# EAGLE design RAMPS_1.4.2.3 (EAGLE 7.5.0)
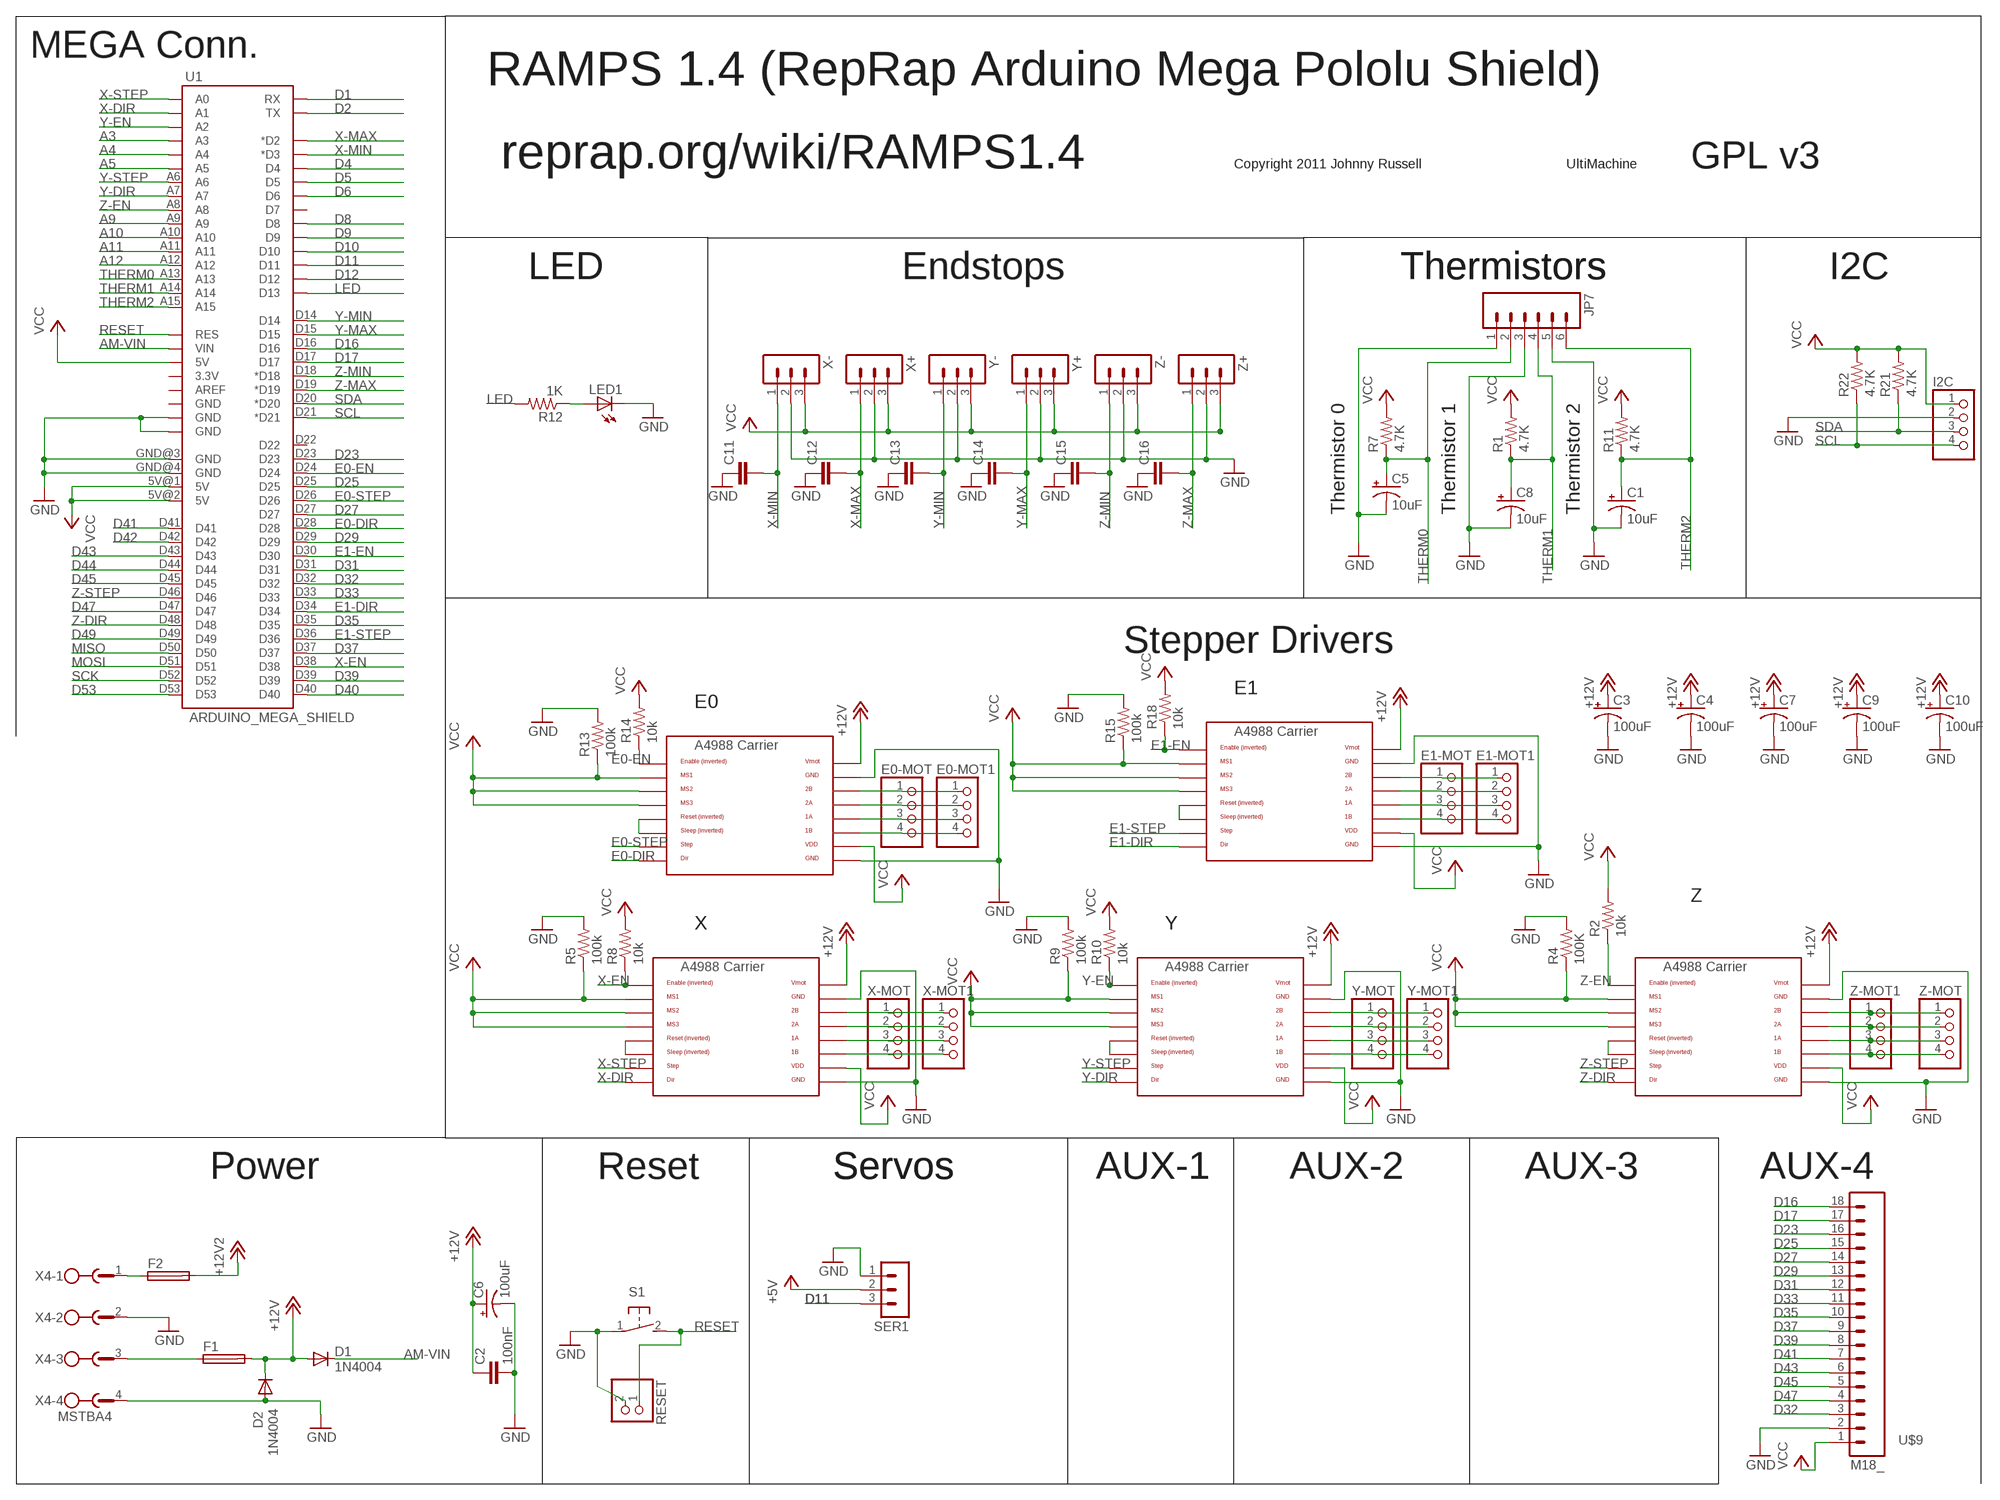
[diagram p0: schematic, sheet 1]

## Parts
C1  10uF  CPOL-US153CLV-0405  [153CLV-0405]
C2  100nF  C-EUC0805  [C0805]
C3  100uF  CPOL-US153CLV-0605  [153CLV-0605]
C4  100uF  CPOL-US153CLV-0605  [153CLV-0605]
C5  10uF  CPOL-US153CLV-0405  [153CLV-0405]
C6  100uF  CPOL-US153CLV-0605  [153CLV-0605]
C7  100uF  CPOL-US153CLV-0605  [153CLV-0605]
C8  10uF  CPOL-US153CLV-0405  [153CLV-0405]
C9  100uF  CPOL-US153CLV-0605  [153CLV-0605]
C10  100uF  CPOL-US153CLV-0605  [153CLV-0605]
C11  C-EUC0805  [C0805]
C12  C-EUC0805  [C0805]
C13  C-EUC0805  [C0805]
C14  C-EUC0805  [C0805]
C15  C-EUC0805  [C0805]
C16  C-EUC0805  [C0805]
D1  1N4004  [DO41-10]
D2  1N4004  [DO41-10]
E0-MOT  PINHD-1X4  [1X04]
E0-MOT1  PINHD-1X4  [1X04]
E1-MOT  PINHD-1X4  [1X04]
E1-MOT1  PINHD-1X4  [1X04]
F1  FUSE_MCCQ-122  [FUSE_MCCQ-122]
F2  FUSE_MCCQ-122  [FUSE_MCCQ-122]
I2C  PINHD-1X4  [1X04]
JP7  M06SIP  [1X06]
LED1  LEDCHIP-LED0805  [CHIP-LED0805]
R1  4.7K  R-US_R0805  [R0805]
R2  10k  RES-US1206FAB  [R1206FAB]
R4  100K  RES-US1206FAB  [R1206FAB]
R5  100k  RES-US1206FAB  [R1206FAB]
R7  4.7K  R-US_R0805  [R0805]
R8  10k  RES-US1206FAB  [R1206FAB]
R9  100k  RES-US1206FAB  [R1206FAB]
R10  10k  RES-US1206FAB  [R1206FAB]
R11  4.7K  R-US_R0805  [R0805]
R12  1K  R-US_R0805  [R0805]
R13  100k  RES-US1206FAB  [R1206FAB]
R14  10k  RES-US1206FAB  [R1206FAB]
R15  100k  RES-US1206FAB  [R1206FAB]
R18  10k  RES-US1206FAB  [R1206FAB]
R21  4.7K  R-US_R0805  [R0805]
R22  4.7K  R-US_R0805  [R0805]
RESET  PINHD-2  [PINHD-2]
S1  31-XX  [B3F-31XX]
SER1  3PIN-HEADER  [3PIN-HEADER]
U1  ARDUINO_MEGA_SHIELD  [ARDUINO_MEGA_SHIELD]
U$4  A4988BREAKOUT  [A4988BREAKOUT]
U$5  A4988BREAKOUT  [A4988BREAKOUT]
U$6  A4988BREAKOUT  [A4988BREAKOUT]
U$7  A4988BREAKOUT  [A4988BREAKOUT]
U$8  A4988BREAKOUT  [A4988BREAKOUT]
U$9  M18_  [1X18]
X4  MSTBA4  [MSTBA4]
X+  3PIN-HEADER  [3PIN-HEADER]
X-  3PIN-HEADER  [3PIN-HEADER]
X-MOT  PINHD-1X4  [1X04]
X-MOT1  PINHD-1X4  [1X04]
Y+  3PIN-HEADER  [3PIN-HEADER]
Y-  3PIN-HEADER  [3PIN-HEADER]
Y-MOT  PINHD-1X4  [1X04]
Y-MOT1  PINHD-1X4  [1X04]
Z+  3PIN-HEADER  [3PIN-HEADER]
Z-  3PIN-HEADER  [3PIN-HEADER]
Z-MOT  PINHD-1X4  [1X04]
Z-MOT1  PINHD-1X4  [1X04]

## Nets
+5V: SER1.2
+12V: C2.1 C3.+ C4.+ C6.+ C7.+ C9.+ C10.+ D1.A D2.C F1.2-1 F1.2-2 U$4.VMOT U$5.VMOT U$6.VMOT U$7.VMOT U$8.VMOT
+12V2: F2.2-1 F2.2-2
A3: U1.A3
A4: U1.A4
A5: U1.A5
A9: U1.A9
A10: U1.A10
A11: U1.A11
A12: U1.A12
AM-VIN: D1.C U1.VIN
D1: U1.RX
D2: U1.TX
D4: U1.D4
D5: U1.D5
D6: U1.D6
D8: U1.D8
D9: U1.D9
D10: U1.D10
D11: SER1.3 U1.D11
D12: U1.D12
D16: U1.D16 U$9.18
D17: U1.D17 U$9.17
D23: U1.D23 U$9.16
D25: U1.D25 U$9.15
D27: U1.D27 U$9.14
D29: U1.D29 U$9.13
D31: U1.D31 U$9.12
D32: U1.D32 U$9.3
D33: U1.D33 U$9.11
D35: U1.D35 U$9.10
D37: U1.D37 U$9.9
D39: U1.D39 U$9.8
D40: U1.D40
D41: U1.D41 U$9.7
D42: U1.D42
D43: U1.D43 U$9.6
D44: U1.D44
D45: U1.D45 U$9.5
D47: U1.D47 U$9.4
D49: U1.D49
D53: U1.D53
E0-DIR: U1.D28 U$4.DIR
E0-EN: R14.1 U1.D24 U$4.EN
E0-STEP: U1.D26 U$4.STEP
E1-DIR: U1.D34 U$5.DIR
E1-EN: R18.1 U1.D30 U$5.EN
E1-STEP: U1.D36 U$5.STEP
GND: C1.- C2.2 C3.- C4.- C5.- C6.- C7.- C8.- C9.- C10.- C11.1 C12.1 C13.1 C14.1 C15.1 C16.1 D2.A I2C.2 JP7.1 JP7.3 JP7.5 LED1.C R4.2 R5.2 R9.2 R13.2 R15.2 RESET.2 S1.1(P) SER1.1 U1.GND@0(GND) U1.GND@1(GND) U1.GND@3(GND) U1.GND@4(GND) U$4.GND U$4.GND@0(GND) U$5.GND U$5.GND@0(GND) U$6.GND U$6.GND@0(GND) U$7.GND U$7.GND@0(GND) U$8.GND U$8.GND@0(GND) U$9.2 X4.2 X4.4 X+.2 X-.2 Y+.2 Y-.2 Z+.2 Z-.2
LED: R12.2 U1.D13
MISO: U1.D50
MOSI: U1.D51
N$3: E0-MOT1.1 E0-MOT.1 U$4.2B
N$4: E0-MOT1.2 E0-MOT.2 U$4.2A
N$8: U$4.RST U$4.SLP(SLEEP)
N$10: E0-MOT1.3 E0-MOT.3 U$4.1A
N$11: E0-MOT1.4 E0-MOT.4 U$4.1B
N$12: E1-MOT1.1 E1-MOT.1 U$5.2B
N$13: E1-MOT1.2 E1-MOT.2 U$5.2A
N$16: E1-MOT1.3 E1-MOT.3 U$5.1A
N$18: E1-MOT1.4 E1-MOT.4 U$5.1B
N$20: U$6.RST U$6.SLP(SLEEP)
N$21: U$6.2B X-MOT1.1 X-MOT.1
N$22: U$6.2A X-MOT1.2 X-MOT.2
N$23: U$7.RST U$7.SLP(SLEEP)
N$24: U$5.RST U$5.SLP(SLEEP)
N$26: U$6.1A X-MOT1.3 X-MOT.3
N$27: U$6.1B X-MOT1.4 X-MOT.4
N$28: U$7.2B Y-MOT1.1 Y-MOT.1
N$29: U$7.2A Y-MOT1.2 Y-MOT.2
N$30: U$7.1A Y-MOT1.3 Y-MOT.3
N$36: U$7.1B Y-MOT1.4 Y-MOT.4
N$38: U$8.RST U$8.SLP(SLEEP)
N$41: U$8.2B Z-MOT1.1 Z-MOT.1
N$42: U$8.2A Z-MOT1.2 Z-MOT.2
N$43: U$8.1A Z-MOT1.3 Z-MOT.3
N$44: U$8.1B Z-MOT1.4 Z-MOT.4
N$46: LED1.A R12.1
N$53: F2.1-1 F2.1-2 X4.1
N$54: F1.1-1 F1.1-2 X4.3
RESET: RESET.1 S1.2(S) U1.RES
SCK: U1.D52
SCL: I2C.4 R22.1 U1.D21(*D21)
SDA: I2C.3 R21.1 U1.D20(*D20)
THERM0: C5.+ JP7.2 R7.1 U1.A13
THERM1: C8.+ JP7.4 R1.1 U1.A14
THERM2: C1.+ JP7.6 R11.1 U1.A15
VCC: I2C.1 R1.2 R2.2 R4.1 R5.1 R7.2 R8.2 R9.1 R10.2 R11.2 R13.1 R14.2 R15.1 R18.2 R21.2 R22.2 U1.5V@0(5V) U1.5V@1(5V) U1.5V@2(5V) U$4.MS1 U$4.MS2 U$4.MS3 U$4.VDD U$5.MS1 U$5.MS2 U$5.MS3 U$5.VDD U$6.MS1 U$6.MS2 U$6.MS3 U$6.VDD U$7.MS1 U$7.MS2 U$7.MS3 U$7.VDD U$8.MS1 U$8.MS2 U$8.MS3 U$8.VDD U$9.1 X+.3 X-.3 Y+.3 Y-.3 Z+.3 Z-.3
X-DIR: U1.A1 U$6.DIR
X-EN: R8.1 U1.D38 U$6.EN
X-MAX: C12.2 U1.D2(*D2) X+.1
X-MIN: C11.2 U1.D3(*D3) X-.1
X-STEP: U1.A0 U$6.STEP
Y-DIR: U1.A7 U$7.DIR
Y-EN: R10.1 U1.A2 U$7.EN
Y-MAX: C14.2 U1.D15 Y+.1
Y-MIN: C13.2 U1.D14 Y-.1
Y-STEP: U1.A6 U$7.STEP
Z-DIR: U1.D48 U$8.DIR
Z-EN: R2.1 U1.A8 U$8.EN
Z-MAX: C16.2 U1.D19(*D19) Z+.1
Z-MIN: C15.2 U1.D18(*D18) Z-.1
Z-STEP: U1.D46 U$8.STEP
Unconnected: U1.3.3V U1.AREF U1.D7 U1.D22 U1.GND@2(GND)

## Notes on the sheet
- MEGA Conn.
- RAMPS 1.4 (RepRap Arduino Mega Pololu Shield)
- reprap.org/wiki/RAMPS1.4 | Copyright 2011 Johnny Russell | UltiMachine | GPL v3
- LED | Endstops | Thermistors | Thermistors | I2C
- Thermistor 0 | Thermistor 1 | Thermistor 2
- Stepper Drivers
- E1
- E0
- Z
- X | Y
- Power | Reset | Servos | Servos | AUX-1 | AUX-2 | AUX-3 | AUX-4

## Library data of the parts
C1 C3-C10 = adafruit:CPOL-US: POLARIZED CAPACITOR, American symbol
C2 = resistor:C-EU: CAPACITOR, European symbol
C11-C16 = rcl:C-EU: CAPACITOR, European symbol
D1 D2 = diode:1N4004: DIODE general purpose rectifier, 1 A
E0-MOT E0-MOT1 E1-MOT E1-MOT1 I2C X-MOT X-MOT1 Y-MOT Y-MOT1 Z-MOT Z-MOT1 = RepRapjr:PINHD-1X4: PIN HEADER
F1 F2 = myLib:FUSE_MCCQ-122
JP7 = SparkFun:M06: Header 6 Standard 6-pin 0.1" header. Use with straight break away headers (SKU : PRT-00116), right angle break away headers (PRT-00553), swiss pins (PRT-00743), machine pins (PRT-00117), and female headers (PRT-00115). Molex polarized connector foot print use with SKU : PRT-08094 with associated crimp pins and housings. NOTES ON THE VARIANTS LOCK and LOCK_LONGPADS... This footprint was designed to help hold the alignment of a through-hole component (i.e. 6-pin header) while soldering it into place. You may notice that each hole has been shifted either up or down by 0.005 of an inch from it's more standard position (which is a perfectly straight line). This slight alteration caused the pins (the squares in the middle) to touch the edges of the holes. Because they are alternating, it causes a "brace" to hold the component in place. 0.005 has proven to be the perfect amount of "off-center" position when using our standard breakaway headers. Although looks a little odd when you look at the bare footprint, once you have a header in there, the alteration is very hard to notice. Also, if you push a header all the way into place, it is covered up entirely on the bottom side. This idea of altering the position of holes to aid alignment will be further integrated into the Sparkfun Library for other footprints. It can help hold any component with 3 or more connection pins.
LED1 = led:LED: LED OSRAM: - CHIPLED LG R971, LG N971, LY N971, LG Q971, LY Q971, LO R971, LY R971 LH N974, LH R974 LS Q976, LO Q976, LY Q976 LO Q996 - Hyper CHIPLED LW Q18S LB Q993, LB Q99A, LB R99A - SideLED LS A670, LO A670, LY A670, LG A670, LP A670 LB A673, LV A673, LT A673, LW A673 LH A674 LY A675 LS A676, LA A676, LO A676, LY A676, LW A676 LS A679, LY A679, LG A679 - Hyper Micro SIDELED® LS Y876, LA Y876, LO Y876, LY Y876 LT Y87S - SmartLED LW L88C, LW L88S LB L89C, LB L89S, LG L890 LS L89K, LO L89K, LY L89K LS L896, LA L896, LO L896, LY L896 - TOPLED LS T670, LO T670, LY T670, LG T670, LP T670 LSG T670, LSP T670, LSY T670, LOP T670, LYG T670 LG T671, LOG T671, LSG T671 LB T673, LV T673, LT T673, LW T673 LH T674 LS T676, LA T676, LO T676, LY T676, LB T676, LH T676, LSB T676, LW T676 LB T67C, LV T67C, LT T67C, LS T67K, LO T67K, LY T67K, LW E67C LS E67B, LA E67B, LO E67B, LY E67B, LB E67C, LV E67C, LT E67C LW T67C LS T679, LY T679, LG T679 LS T770, LO T770, LY T770, LG T770, LP T770 LB T773, LV T773, LT T773, LW T773 LH T774 LS E675, LA E675, LY E675, LS T675 LS T776, LA T776, LO T776, LY T776, LB T776 LHGB T686 LT T68C, LB T68C - Hyper Mini TOPLED® LB M676 - Mini TOPLED Santana® LG M470 LS M47K, LO M47K, LY M47K Source: http://www.osram.convergy.de LUXEON: - LUMILED® LXK2-PW12-R00, LXK2-PW12-S00, LXK2-PW14-U00, LXK2-PW14-V00 LXK2-PM12-R00, LXK2-PM12-S00, LXK2-PM14-U00 LXK2-PE12-Q00, LXK2-PE12-R00, LXK2-PE12-S00, LXK2-PE14-T00, LXK2-PE14-U00 LXK2-PB12-K00, LXK2-PB12-L00, LXK2-PB12-M00, LXK2-PB14-N00, LXK2-PB14-P00, LXK2-PB14-Q00 LXK2-PR12-L00, LXK2-PR12-M00, LXK2-PR14-Q00, LXK2-PR14-R00 LXK2-PD12-Q00, LXK2-PD12-R00, LXK2-PD12-S00 LXK2-PH12-R00, LXK2-PH12-S00 LXK2-PL12-P00, LXK2-PL12-Q00, LXK2-PL12-R00 Source: www.luxeon.com KINGBRIGHT: KA-3528ASYC Source: www.kingbright.com
R1 R7 R11 R12 R21 R22 = adafruit:R-US_: RESISTOR, American symbol
R2 R4 R5 R8-R10 R13-R15 R18 = fab:RES-US: Resistor (US Symbol) Variants with postfix FAB are widened to allow the routing of internal traces
RESET = myLib:PINHD-2
S1 = switch-omron:31-XX: OMRON SWITCH; MPN: B3F-3100; OC_FARNELL: 959704; OC_NEWARK: 36M3582
SER1 X+ X- Y+ Y- Z+ Z- = ultimachine:3PIN-HEADER: PIN HEADER
U1 = RepRapjr:ARDUINO_MEGA_SHIELD
U$4-U$8 = RepRapjr:A4988BREAKOUT
U$9 = SparkFun:M18
X4 = con-phoenix-508:MSTBA4: PHOENIX

## Board
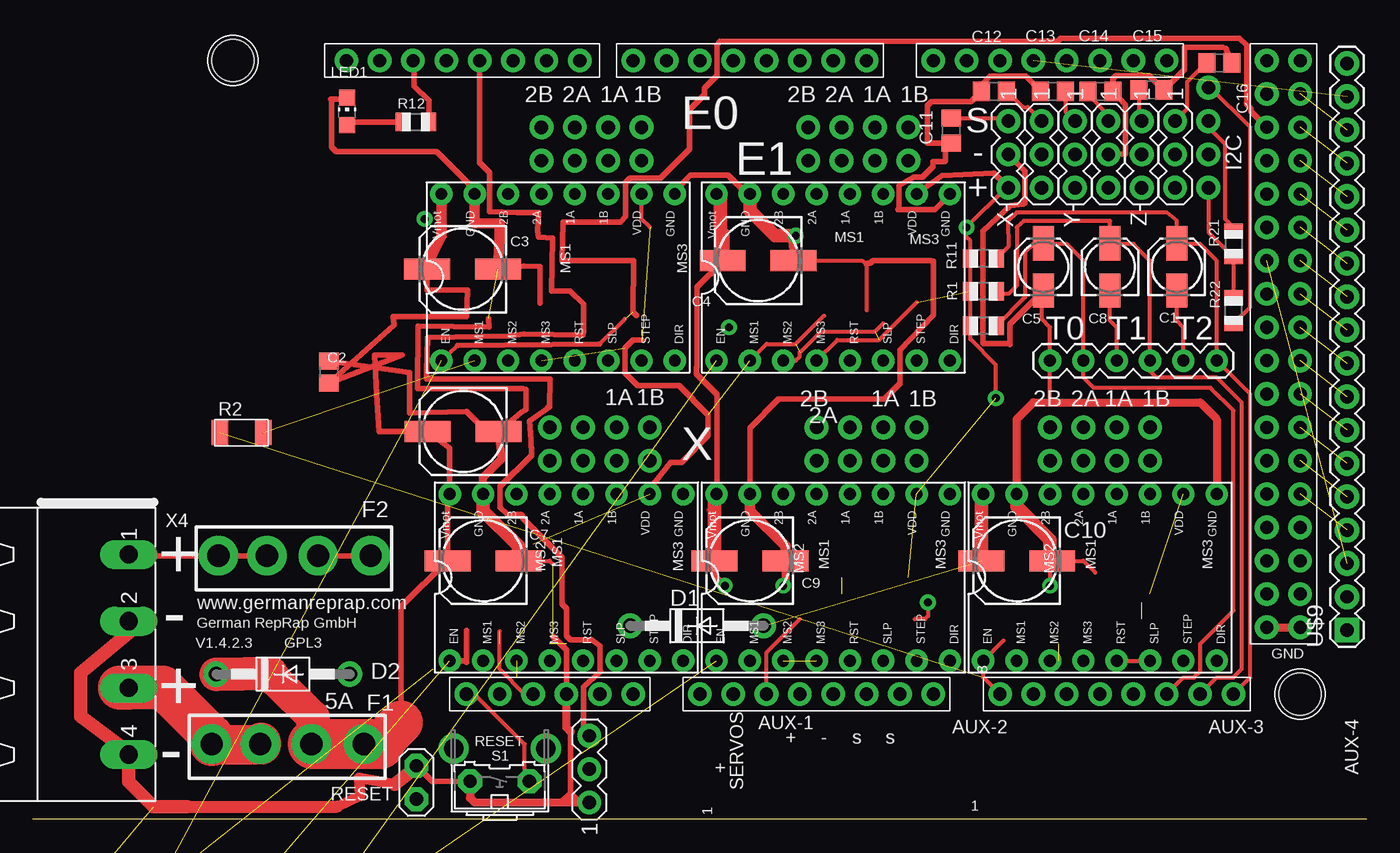
[diagram p1: board, top side]
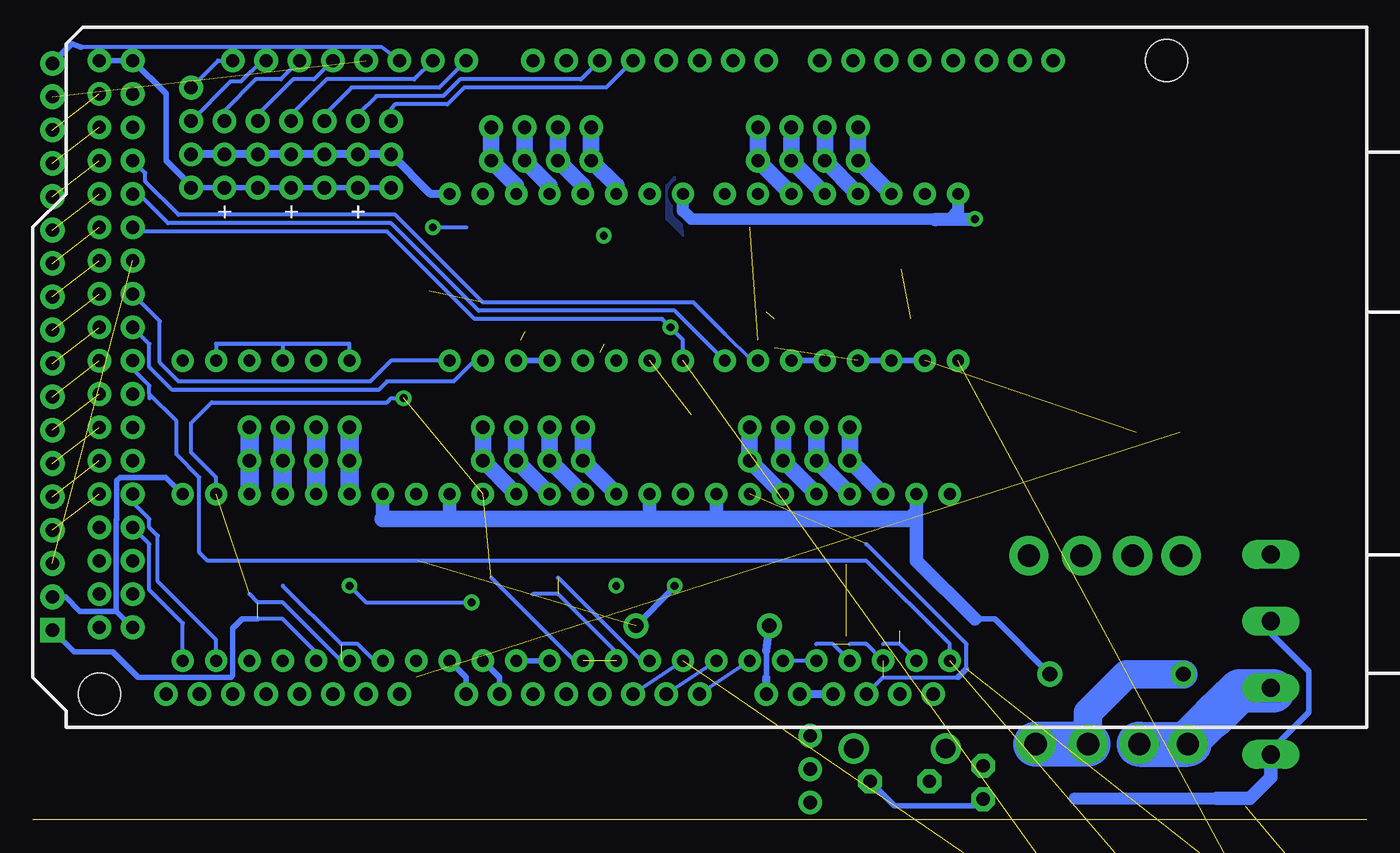
[diagram p2: board, bottom side, seen from below]

Size 101.59 x 0 mm. Coordinates in mm from the lower left corner, seen from the top.
Outline: 101.59,0 0,0
Copper layers (1*16): Top 0.035mm / dielectric 1.6mm / Bottom 0.035mm
Design rules "PCB-CART *": minimum track width 0.2mm, minimum drill 0.4mm, track to track 0.3mm, track to pad 0.3mm, pad to pad 0.2mm, via to via 0.2mm, smd to smd 0.2mm, copper to edge 0.2mm, drill to drill 0.2mm, minimum pad ring 0.4mm, minimum via ring 0.3mm, stop-mask expansion 3mil, vias tented up to drill 0.5mm, thermal gap 12mil

### Footprints (pad centres in the part's own frame; a part is rotated, then mirrored left to right if it is on the bottom)
153CLV-0405 = smd 2.6 x 1.6: + 1.8,0; - -1.8,0
C0805 = smd 1.3 x 1.5: 1 -0.85,0; 2 0.85,0
153CLV-0605 = smd 3.5 x 1.6: + 2.7,0; - -2.7,0
C0805' = smd 1.3 x 1.5: 1 -0.95,0; 2 0.95,0
DO41-10 = drill 1.118: A 5.08,0; C -5.08,0
1X04 = drill 1.016: 1 -2.54,0; 2 0,0; 3 2.54,0; 4 5.08,0
FUSE_MCCQ-122 = drill 1.7 pad 3: 1-1 -6.7,0; 1-2 -3,0; 2-1 4.9,0; 2-2 0.9,0
1X06 = drill 0.9 pad 1.422: 1 0,0; 2 2.54,0; 3 5.08,0; 4 7.62,0; 5 10.16,0; 6 12.7,0
CHIP-LED0805 = smd 1.2 x 1.2: A 0,-1.05; C 0,1.05
R0805 = smd 1.1 x 1.4: 1 -1,0; 2 1,0
R1206FAB = smd 1.27 x 1.905: 1 -1.651,0; 2 1.651,0
PINHD-2 = drill 1.016 octagon: 1 -1.27,0; 2 1.27,0
B3F-31XX = drill 1.016 octagon: 1 -2.261,-1.245; 2 2.261,-1.245 | drill 1.499 pad 2.159: 3 -3.505,1.245; 4 3.505,1.245
3PIN-HEADER = drill 1.016: 1 -2.54,0; 2 0,0; 3 2.54,0
ARDUINO_MEGA_SHIELD = drill 1 pad 1.422: 3.3V 35.56,2.54; 5V@0 38.1,2.54; 5V@1 93.98,50.8; 5V@2 96.52,50.8; A0 50.8,2.54; A1 53.34,2.54; A2 55.88,2.54; A3 58.42,2.54; A4 60.96,2.54; A5 63.5,2.54; A6 66.04,2.54; A7 68.58,2.54; A8 73.66,2.54; A9 76.2,2.54; A10 78.74,2.54; A11 81.28,2.54; A12 83.82,2.54; A13 86.36,2.54; A14 88.9,2.54; A15 91.44,2.54; AREF 23.876,50.8; D2 58.42,50.8; D3 55.88,50.8; D4 53.34,50.8; D5 50.8,50.8; D6 48.26,50.8; D7 45.72,50.8; D8 41.656,50.8; D9 39.116,50.8; D10 36.576,50.8; D11 34.036,50.8; D12 31.496,50.8; D13 28.956,50.8; D14 68.58,50.8; D15 71.12,50.8; D16 73.66,50.8; D17 76.2,50.8; D18 78.74,50.8; D19 81.28,50.8; D20 83.82,50.8; D21 86.36,50.8; D22 93.98,48.26; D23 96.52,48.26; D24 93.98,45.72; D25 96.52,45.72; D26 93.98,43.18; D27 96.52,43.18; D28 93.98,40.64; D29 96.52,40.64; D30 93.98,38.1; D31 96.52,38.1; D32 93.98,35.56; D33 96.52,35.56; D34 93.98,33.02; D35 96.52,33.02; D36 93.98,30.48; D37 96.52,30.48; D38 93.98,27.94; D39 96.52,27.94; D40 93.98,25.4; D41 96.52,25.4; D42 93.98,22.86; D43 96.52,22.86; D44 93.98,20.32; D45 96.52,20.32; D46 93.98,17.78; D47 96.52,17.78; D48 93.98,15.24; D49 96.52,15.24; D50 93.98,12.7; D51 96.52,12.7; D52 93.98,10.16; D53 96.52,10.16; GND@0 40.64,2.54; GND@1 43.18,2.54; GND@2 26.416,50.8; GND@3 93.98,7.62; GND@4 96.52,7.62; RES 33.02,2.54; RX 63.5,50.8; TX 60.96,50.8; VIN 45.72,2.54 | hole 3.2: 96.52,2.54; 15.24,50.8
A4988BREAKOUT = drill 0.9: 1A 8.89,1.27; 1B 11.43,1.27; 2A 6.35,1.27; 2B 3.81,1.27; DIR 16.51,-11.43; EN -1.27,-11.43; GND 16.51,1.27; GND@0 1.27,1.27; MS1 1.27,-11.43; MS2 3.81,-11.43; MS3 6.35,-11.43; RST 8.89,-11.43; SLP 11.43,-11.43; STEP 13.97,-11.43; VDD 13.97,1.27; VMOT -1.27,1.27
1X18 = drill 1.016 pad 1.88 square: 1 0,0 | drill 1.016 pad 1.88: 2 2.54,0; 3 5.08,0; 4 7.62,0; 5 10.16,0; 6 12.7,0; 7 15.24,0; 8 17.78,0; 9 20.32,0; 10 22.86,0; 11 25.4,0; 12 27.94,0; 13 30.48,0; 14 33.02,0; 15 35.56,0; 16 38.1,0; 17 40.64,0; 18 43.18,0
MSTBA4 = drill 1.397 long: 1 -7.62,5.08; 2 -2.54,5.08; 3 2.54,5.08; 4 7.62,5.08

### Placement (x,y rotation side)
C1  87.12,42.06 90 top  (outside the outline)
C2  22.55,34.06 90 top  (outside the outline)
C3  32.74,41.89 180 top  (outside the outline)
C4  55.24,42.54 180 top  (outside the outline)
C5  76.96,42.06 90 top  (outside the outline)
C6  32.77,29.54 180 top  (outside the outline)
C7  34.29,19.69 180 top  (outside the outline)
C8  82.04,42.06 90 top  (outside the outline)
C9  54.61,19.69 180 top  (outside the outline)
C10  74.93,19.69 180 top  (outside the outline)
C11  [C0805']  69.95,52.45 90 top  (outside the outline)
C12  [C0805']  73.2,55.45 0 top  (outside the outline)
C13  [C0805']  77.7,55.45 0 top  (outside the outline)
C14  [C0805']  81.3,55.45 180 top  (outside the outline)
C15  [C0805']  85.2,55.54 180 top  (outside the outline)
C16  [C0805']  90.35,57.59 180 top  (outside the outline)
D1  50.57,14.73 0 top  (outside the outline)
D2  19.05,11.05 0 top  (outside the outline)
E0-MOT  41.27,52.7 0 top  (outside the outline)
E0-MOT1  41.27,50.16 0 top  (outside the outline)
E1-MOT  61.59,52.7 0 top  (outside the outline)
E1-MOT1  61.59,50.16 0 top  (outside the outline)
F1  20.32,5.71 0 top  (outside the outline)
F2  20.83,20.07 0 top  (outside the outline)
I2C  89.53,50.64 90 top  (outside the outline)
JP7  77.47,34.92 0 top  (outside the outline)
LED1  23.93,53.91 0 top  (outside the outline)
R1  72.39,40.22 180 top  (outside the outline)
R2  15.9,29.45 0 top  (outside the outline)
R4  -14.95,-25.76 0 top  (outside the outline)
R5  -14.95,-40.41 0 top  (outside the outline)
R7  72.39,37.58 180 top  (outside the outline)
R8  -14.95,-44.16 0 top  (outside the outline)
R9  -14.95,-31.2 0 top  (outside the outline)
R10  -14.95,-34.95 0 top  (outside the outline)
R11  72.39,42.7 180 top  (outside the outline)
R12  29.18,53.11 0 top  (outside the outline)
R13  -14.95,-49.61 0 top  (outside the outline)
R14  -14.95,-53.36 0 top  (outside the outline)
R15  -14.95,-57.11 0 top  (outside the outline)
R18  -14.95,-60.86 0 top  (outside the outline)
R21  91.44,43.81 270 top  (outside the outline)
R22  91.44,38.73 90 top  (outside the outline)
RESET  29.21,2.79 90 top
S1  35.56,4.13 0 top
SER1  42.39,3.81 90 top
U1  0,6.98 0 top  (outside the outline)
U$4  32.38,46.35 0 top  (outside the outline)
U$5  53.34,46.35 0 top  (outside the outline)
U$6  33.02,23.49 0 top  (outside the outline)
U$7  53.34,23.49 0 top  (outside the outline)
U$8  73.66,23.49 0 top  (outside the outline)
U$9  100.1,14.39 90 top  (outside the outline)
X4  2.22,12.54 270 top  (outside the outline)
X+  76.83,50.64 270 top  (outside the outline)
X-  74.3,50.64 270 top  (outside the outline)
X-MOT  41.91,29.84 0 top  (outside the outline)
X-MOT1  41.91,27.3 0 top  (outside the outline)
Y+  81.92,50.64 270 top  (outside the outline)
Y-  79.38,50.64 270 top  (outside the outline)
Y-MOT  62.23,29.84 0 top  (outside the outline)
Y-MOT1  62.23,27.3 0 top  (outside the outline)
Z+  87,50.64 270 top  (outside the outline)
Z-  84.45,50.64 270 top  (outside the outline)
Z-MOT  80.01,29.84 0 top  (outside the outline)
Z-MOT1  80.01,27.3 0 top  (outside the outline)

### Tracks (layer width: path | path; a pad name or v marks a point on that pad's centre or on a via)
+12V  (via drill 0.6)  (1 unrouted)
  Top 0.2: 21.59,5.71 F1.2-2
  Top 0.406: C9.+ 51.91,18.57 v52.7,17.78 | C3.+ 30.04,40.29 33.1,40.29 33.05,38.29 27.45,38.29 27.5,37.64 C2.1 28.13,35.34 26.05,35.34 26.2,32.39 26.36,29.54 C6.+ 31.75,28.26 U$6.VMOT 31.59,24.6 C7.+ 31.54,19.69 28.05,16.2 28.05,7.38 28.07,7.37 | U$7.VMOT 52.1,24.79 52.1,32.34 50.55,33.89 50.55,34.39 50.6,34.45 50.6,40.54 52.55,42.49 C4.+
  Top 0.813: C3.+ 30.44,43.07 31.11,44.45 U$4.VMOT
  Top 1.016: C9.+ 51.91,24.6 U$7.VMOT | C10.+ 72.23,24.6 U$8.VMOT | C4.+ 52.55,44.61 52.39,44.77 52.39,47.31 U$5.VMOT
  Top 2.54: D2.C 18.14,11.1 18.54,10.54 21.34,7.75 21.34,5.83
  Top 3.302: 21.34,5.83 F1.2-2 | 26.42,5.71 28.07,7.37
  Top 3.81: 26.42,5.71 21.59,5.71 21.34,5.71
  Bottom 0.406: v52.7,17.78 52.7,17.68 D1.A
  Bottom 0.914: U$4.VMOT 31.11,46.35 31.75,45.72 32.84,45.67 51.44,45.72 52.07,46.35 U$5.VMOT
  Bottom 1.016: 32.84,45.67 v29.84,45.72
  Bottom 1.27: U$6.VMOT
  Bottom 2.184: F1.2-2 21.25,8.09 18.29,11.05 D2.C
  Bottom 3.429: F1.2-2 F1.2-1
  pour Top: 51.44,24.13 51.44,23.49 52.07,24.77
+12V2
  Top 0.406: F2.2-2 F2.2-1
AM-VIN
  Bottom 0.406: 45.72,10.79 45.72,12.81
  Bottom 0.61: 45.72,12.81 D1.C | U1.VIN 45.72,10.79
D11
  Top 0.406: SER1.3 41.95,6.79 41.95,10.1 43.25,11.24 43.2,11.39 43.2,13.19 42.6,13.64 40.95,13.64 40.65,13.94 40.65,16.05 40.3,16.39 40.3,19.95 37.3,22.95 37.3,23.09 37.2,23.2 36.15,23.2 35.6,23.74 35.6,25.34 38,27.7 37.95,28.84 | 38,27.89 37.95,28.84 | 37.95,28.84 37.85,30.34 39.35,31.39 | 39.2,31.34 39.35,31.39 | 39.35,31.39 39.4,33.54 30,33.54 30,34.09 30.05,36.7 36.25,36.79 37.4,36.95 41.9,36.89 41.95,37.09 41.95,39.24 40.9,40.24 39.5,40.24 39.6,44.24 38.5,44.34 38.45,44.84 38.5,46.2 36.9,46.2 34.8,46.29 34.8,49.24 34.04,50.01 U1.D11
D16
  Bottom 0.305: 97.89,58.8 75.03,58.8 U1.D16
  Bottom 0.406: U$9.18 98.62,59.05 97.89,58.8
D17  (1 unrouted)
D23  (1 unrouted)
D25  (1 unrouted)
D27  (1 unrouted)
D29  (1 unrouted)
D31  (1 unrouted)
D32  (1 unrouted)
D33  (1 unrouted)
D35  (1 unrouted)
D37  (1 unrouted)
D39  (1 unrouted)
D41  (1 unrouted)
D43  (1 unrouted)
D45  (1 unrouted)
D47  (1 unrouted)
E0-DIR
  Bottom 0.305: U1.D28 93.5,47.62 91.28,45.4 74.3,45.4 67.63,38.73 52.7,38.73 U$4.DIR
E0-EN  (2 unrouted)
  Top 0.305: 43.18,36.2 45.09,38.1 | U$4.EN 32.34,36.09
  Top 0.406: 32.34,36.09 43.18,36.2 | U1.D24 92.75,53.93 92.75,54.14 92.45,54.45 92.45,58.95 91.9,59.49 78.3,59.49 78.05,59.24 52.35,59.24 52.1,58.99 52.1,56.65 51.15,55.7 51.15,55.2 50,54.04 50,51.04 47.8,48.84 45.5,48.84 45.15,48.49 45.15,45.89 44.75,45.49 40.4,45.49 40.3,42.54 45.75,42.54 45.7,38.64 45.99,38.35
E0-STEP
  Bottom 0.254: 48.9,36.99 46.83,34.92 U$4.STEP
  Bottom 0.305: U1.D26 93.03,49.21 93.03,48.58 90.49,46.04 73.98,46.04 67.31,39.37 51.28,39.37 48.9,36.99
E1-DIR
  Bottom 0.305: U1.D34 91.92,37.94 91.92,34.77 90.49,33.34 75.88,33.34 74.3,34.92 U$5.DIR
E1-EN  (via drill 0.6)  (1 unrouted)
  Bottom 0.305: U1.D30 93.66,44.77 74.61,44.77 67.94,38.1 53.66,38.1 v53.02,37.46 52.07,36.51 U$5.EN
E1-STEP
  Bottom 0.305: U1.D36 92.71,36.2 92.71,34.45 90.96,32.7 75.25,32.7 74.61,33.34 69.53,33.34 67.94,34.92 U$5.STEP
GND  (via drill 0.6)  (7 unrouted)
  Top 0.305: 80.92,18.78 80.01,19.69 C10.- 77.47,19.52 v77.47,17.78 | C5.- 76.83,40.13 76.83,38.1 77.47,37.46 JP7.1 77.47,31.75 | 67.17,15.24 67.94,15.24 68.17,15.47 v68.17,16.51 | 39.64,19.41 39.37,19.69 C7.- | 63.5,38.77 63.5,42.23 63.18,42.54 C4.- | C8.- 82.04,37.97 82.55,37.46 JP7.3 | C1.- 87.12,37.97 87.63,37.46 JP7.5
  Top 0.406: 40.96,1.9 40.96,6.67 | LED1.C 23.81,54.84 22.7,54.84 22.75,54.79 22.75,51.2 23.1,50.84 30.75,50.84 33.66,47.94 U$4.GND@0 | 29.12,3.86 RESET.2 30.39,2.88 S1.1 | U1.GND@0 40.65,12.89 39.64,13.9 | C3.- 37.39,42.14 38.65,42.09 38.65,39.31 | C2.2 28.7,34.01 28.7,30.95 33.05,31.04 34.41,29.69 C6.- 37.18,30.99 37.55,31.2 37.55,32.74 37.3,32.79 29.3,32.79 29.35,37.54 34.75,37.49 34.7,38.15 | C16.1 90.85,58.74 90.6,58.79 87.7,58.79 87.7,57.09 C15.1 85.05,56.65 82.5,56.65 82.25,56.4 C14.1 83.2,54.45 83.2,50.64 Y+.2 | C13.1 75.65,56.59 72.9,56.59 72.25,55.9 C12.1 71.45,54.64 68.45,54.64 68.15,54.34 68.15,51.49 C11.1 69.5,51.04 69.5,50.14 69.45,50.09 68.55,50.09 68.55,49.7 67.75,48.89 67.05,48.89 65.95,48.24 65.95,46.54 65.9,46.45 68.72,46.45 U$5.GND | C5.- 74.4,37.7 74.4,36.14 74.3,36.24 72.4,36.24 72.35,36.29 72.35,44.79 74.45,46.74 75.45,46.84 75.55,46.95 75.55,49.34 X-.2 | U$5.GND@0 54.09,48.14 53.85,48.14 52.95,49.04 50.1,49.04 48.9,47.84 U$4.GND | 63.5,42.23 63.62,42.34 63.8,42.34 64,42.54 68.4,42.54 68.6,42.49 68.6,38.39 66.05,35.74 66.05,33.2 64.85,31.99 56.8,31.99 54.61,29.8 U$7.GND@0
  Top 0.61: U1.GND@3 U1.GND@4 | U$8.GND 90.17,30.48 88.9,31.75 77.47,31.75 76.2,31.75 74.93,30.48 U$8.GND@0 | S1.1 33.3,1.63 33.66,1.27 40.32,1.27 | 40.96,1.27 40.96,1.9 | 40.96,6.67 40.64,6.98 U1.GND@0 | 40.32,1.27 40.96,1.27 | 57.78,44.45 57.95,43.02 C4.- 57.95,44.29 v58.1,44.45 | v57.15,17.78 57.31,17.94 C9.- | 40.96,1.27 41.59,1.27 | 41.59,1.27 SER1.1 | SER1.1 | 40.32,1.27 40.96,1.9 | 40.96,1.9 41.59,1.27 | C6.- 35.72,27.46 34.29,26.03 U$6.GND@0 | U$6.GND@0
  Top 0.813: C3.- 35.54,44.19 35.56,45.37 33.64,45.42 33.66,46.35 U$4.GND@0 | C9.- 57.31,20.8 54.61,23.49 U$7.GND@0 | 23.18,0.95 24.92,1.79 24.85,3.16 27.55,2.64
  Top 0.914: 11.75,0.95 23.18,0.95
  Top 1.016: C7.- 36.99,20.8 34.29,23.49 U$6.GND@0 | U$8.GND@0 74.93,23.81 77.47,21.27 77.47,19.84 C10.- | U$5.GND@0 54.61,46.35 56.52,44.45 57.78,44.45 | 11.75,0.95 9.21,0.95 7.3,2.86 7.3,5.08 3.65,7.83 3.65,11.14 7.3,14.2 X4.2 | 27.55,2.64 29.12,3.86
  Bottom 0.305: 77.47,35.24 JP7.1 77.47,36.2 82.55,36.2 | v68.17,16.51 76.2,16.51 v77.47,17.78 | 82.55,36.2 JP7.3 | 82.55,36.2 87.63,36.2 JP7.5 | Z+.2
  Bottom 0.406: D2.A 28.32,15.24 29.84,15.24 | 7.46,5.08 4.4,8.14 4.4,11.24 7.22,14.07 7.22,14.12 7.3,14.2 X4.2 | U1.GND@3 95.22,15.85 | 95.22,15.85 98,15.85 99.09,16.94 U$9.2 | U$8.GND 91.45,26.04 94.95,26.04 95.2,25.79 95.2,22.84 95.22,22.82 95.22,15.85
  Bottom 0.61: I2C.2 Z+.2 Z-.2 Y+.2 Y-.2 X+.2 X-.2 71.28,47.62 U$5.GND | U1.GND@0 U1.GND@1
  Bottom 0.914: 22.23,1.59 11.43,1.59 | 7.62,5.08 7.46,5.08 X4.4 | U$6.GND@0
  Bottom 1.016: 74.93,22.86 U$8.GND@0 | 69.85,22.86 U$7.GND | 54.61,22.86 U$7.GND@0 | U$6.GND | 49.53,22.86 U$6.GND | 34.92,22.86 34.29,23.49 U$6.GND@0 34.29,19.69 29.84,15.24 | 11.43,1.59 8.89,1.59 7.3,3.17 X4.4
  Bottom 1.27: 34.92,22.86 49.53,22.86 54.61,22.86 69.85,22.86 74.93,22.86
  Bottom 1.676: U$6.GND@0
  pour Bottom: 52.07,44.45 53.34,45.72 53.34,48.26 52.7,48.89
LED
  Top 0.406: U1.D13 29.05,57.69 29.05,55.84 30.18,54.71 R12.2
N$3
  Bottom 1.27: U$4.2B E0-MOT1.1 E0-MOT.1 | E0-MOT.1
N$4
  Bottom 1.27: U$4.2A E0-MOT1.2 E0-MOT.2 | E0-MOT.2
N$8
  Bottom 0.406: U$4.RST U$4.SLP
N$10
  Bottom 1.27: U$4.1A E0-MOT1.3 E0-MOT.3 | E0-MOT.3
N$11
  Bottom 1.27: U$4.1B E0-MOT1.4 E0-MOT.4 | E0-MOT.4
N$12
  Bottom 1.27: U$5.2B 57.15,48.26 E1-MOT1.1 E1-MOT.1
N$13
  Bottom 1.27: U$5.2A 59.69,48.26 E1-MOT1.2 E1-MOT.2
N$16
  Bottom 1.27: U$5.1A 62.23,48.26 E1-MOT1.3 E1-MOT.3
N$18
  Bottom 1.27: U$5.1B 64.77,48.26 E1-MOT1.4 E1-MOT.4
N$20
  Bottom 0.305: U$6.RST U$6.SLP
N$21
  Bottom 1.27: U$6.2B | U$6.2B X-MOT1.1 X-MOT.1
N$22
  Bottom 1.27: U$6.2A | U$6.2A X-MOT1.2 X-MOT.2
N$23
  Bottom 0.406: U$7.RST U$7.SLP
N$24
  Bottom 0.406: U$5.RST U$5.SLP
N$26
  Bottom 1.27: U$6.1A | U$6.1A X-MOT1.3 X-MOT.3
N$27
  Bottom 1.27: U$6.1B | U$6.1B X-MOT1.4 X-MOT.4
N$28
  Bottom 1.27: U$7.2B Y-MOT1.1 Y-MOT.1
N$29
  Bottom 1.27: U$7.2A Y-MOT1.2 Y-MOT.2
N$30
  Bottom 1.27: U$7.1A Y-MOT1.3 Y-MOT.3
N$36
  Bottom 1.27: U$7.1B Y-MOT1.4 Y-MOT.4
N$38
  Top 0.305: U$8.RST U$8.SLP
N$41
  Bottom 1.422: U$8.2B Z-MOT1.1 Z-MOT.1
N$42
  Bottom 1.422: U$8.2A Z-MOT1.2 Z-MOT.2
N$43
  Bottom 1.422: U$8.1A Z-MOT1.3 Z-MOT.3
N$44
  Bottom 1.422: U$8.1B Z-MOT1.4 Z-MOT.4
N$46
  Top 0.406: LED1.A 24.17,53.11 R12.1
N$53
  Top 0.406: X4.1 7.4,20.07 F2.1-1 F2.1-2
N$54
  Top 0.305: 13.46,6.17 13.46,6.48 13.3,6.64 | 13.57,5.67 16.5,5.67 | 13.46,6.17 13.46,5.67 13.57,5.67 | 13.46,6.17 9.6,10.03 | 13.57,5.67 F1.1-1 | 13.57,5.67 17.27,5.67 F1.1-2
  Top 3: 17.4,5.84 17.4,5.67 16.5,5.67 13.46,5.67
  Top 3.302: F1.1-1 13.62,6.32 13.3,6.64 9.91,10.03 9.6,10.03 6.6,10.03 6.64,10 X4.3
  Bottom 0.305: 13.46,5.67 13.57,5.67 F1.1-1
  Bottom 3.21: 11.72,7.78 11.76,7.78 13.4,6.14 13.4,5.73 13.46,5.67 13.8,5.67
  Bottom 3.302: 11.72,7.78 9.65,9.78 7.11,9.78
  Bottom 3.429: F1.1-2 F1.1-1
RESET
  Top 0.305: S1.2 37.82,3.45 37.47,3.81 37.47,5.71 33.66,9.53 U1.RES
  Bottom 0.406: RESET.1 29.72,1.02 35.95,1.02 S1.2
SCL
  Top 0.305: R22.1 92.71,39 92.71,52.7 89.69,55.72 I2C.4
  Bottom 0.305: I2C.4 87.47,57.79 U1.D21
SDA
  Top 0.305: R21.1 91.44,45.09 90.81,45.72 90.81,51.43 89.53,52.7 I2C.3
  Bottom 0.305: I2C.3 86.52,56.2 85.72,56.2 84.14,57.79 U1.D20
THERM0
  Top 0.305: U1.A13 87.63,10.79 88.42,10.79 88.9,11.27 88.9,13.33 91.44,15.87 91.44,31.11 89.69,32.86 80.8,32.86 80.01,33.65 JP7.2 80.01,42.54 78.74,43.81 77.01,43.81 C5.+ 76.25,43.86 75.56,43.18 75.56,39.75 R7.1
THERM1
  Top 0.305: U1.A14 90.17,10.79 91.44,10.79 92.08,11.43 92.08,31.75 90.17,33.65 85.57,33.65 85.09,34.13 JP7.4 85.09,42.54 83.82,43.81 82.09,43.81 C8.+ 82.04,45.59 81.81,45.57 75.47,45.57 74.93,45.09 74.93,40.64 74.3,40 73.6,40 R1.1
THERM2
  Top 0.305: U1.A15 92.71,10.79 92.71,32.38 JP7.6 | JP7.6 90.01,35.08 | R11.1 74.3,43.61 74.25,45.57 74.93,46.2 86.36,46.2 87.12,45.59 C1.+ 87.17,43.81 88.9,43.81 90.17,42.54 JP7.6
VCC  (via drill 0.6)  (27 unrouted)
  Top 0.305: 35.56,14.33 35.56,11.43 37.47,9.53 U1.5V@0 | R22.2 R21.2 89.53,44.72 I2C.1 | X-.3 74.14,48.1 v71.12,45.09 71.12,44.35 71.39,44.09 R11.2 R1.2 R7.2 71.39,36.56 73.34,34.61 v73.34,32.07 | U$4.VDD 46.35,45.72 46.99,45.09 | 60.26,38.35 58.1,36.2 55.88,36.2 U$5.MS1 | 64.77,37.78 64.14,37.15 60.01,37.15 58.42,35.56 58.42,35.24 58.1,34.92 U$5.MS2 | 67.31,39.37 64.45,36.51 61.28,36.51 U$5.MS3
  Top 0.406: X-.3 73.18,49.21 69.25,49.01 U$5.VDD | U$6.VDD | 46.4,36.51 45.72,36.51 45.09,35.88 45.09,33.97 46.04,33.02 49.21,33.02 51.44,30.8 51.44,29.21 49.4,27.18 48.58,27.18 46.99,25.21 U$6.VDD
  Bottom 0.305: X-.3 74.3,47.78 | 38.1,20.95 30.48,13.33 30.48,11.43 | 31.11,10.79 36.83,10.79 U1.5V@0 | U$8.VDD 87.63,26.03 89.53,27.94 89.53,30.16 87.95,31.75 74.61,31.75 74.3,32.07 v73.34,32.07 | v71.12,45.09 68.58,45.09 | U$6.MS1 35.56,13.33 36.83,13.33 | U$6.MS2 38.1,13.33 39.37,13.33 | U$6.MS3 40.64,13.33 41.91,13.33 | U$7.MS1 55.24,12.06 61.59,18.41 | U$7.MS2 57.15,12.7 61.59,17.14 63.5,17.14 | U$7.MS3 60.33,12.06 66.67,18.41 | U$8.MS1 75.56,12.06 76.83,13.33 78.11,13.33 82.55,17.78 | U$8.MS2 78.11,12.06 82.55,16.51 84.45,16.51 85.09,17.14 | U$8.MS3 80.01,12.7 82.55,15.24 84.45,15.24 | I2C.1
  Bottom 0.406: I2C.1 Z+.3 Z-.3 Y+.3 Y-.3 X+.3 X-.3 | U1.5V@2 U1.5V@1 91.44,55.24 91.44,50.16 89.53,48.26 | 30.48,11.43 31.11,10.79 | U$4.MS1 U$4.MS2 U$4.MS3 | U$9.1 98.45,12.74 95.5,12.74 93.55,10.79 86.5,10.79 86.35,10.94 86.35,14.54 85.66,15.24 84.45,15.24
  Bottom 0.61: I2C.1 89.53,48.26
X-DIR
  Bottom 0.305: U$6.DIR U1.A1
X-EN  (1 unrouted)
  Top 0.406: 33.05,14.37 33.05,11.94 32.93,12.06 U$6.EN
  Bottom 0.305: U1.D38 93.98,34.29 92.71,33.02 92.71,32.38 | 92.71,32.38 92.71,32.07 | 92.71,32.38 90.65,30.32 90.65,27.78 88.9,26.03 88.9,20.32 88.27,19.69 38.1,19.69 31.75,13.33 U$6.EN | U$6.EN
X-MAX
  Top 0.305: C12.2 74.2,55.45 75.4,54.24 75.77,54.24 X+.1
  Bottom 0.305: X+.1 76.83,53.66 75.41,55.09 70.33,55.09 69.06,56.36 59.85,56.36 U1.D2
X-MIN
  Top 0.305: C11.2 74.08,53.39 X-.1
  Bottom 0.305: X-.1 74.3,54.13 73.98,54.45 70.01,54.45 68.74,55.72 57.94,55.72 U1.D3
X-STEP
  Bottom 0.305: U$6.STEP U1.A0
Y-DIR
  Bottom 0.305: U1.A7
  Bottom 0.406: U1.A7 68.58,10.79 U$7.DIR
Y-EN  (1 unrouted)
  Top 0.305: U1.A2 55.88,12.7 58.42,15.24
  Bottom 0.305: U$7.EN U1.A2
Y-MAX
  Top 0.305: C14.2 80.35,55.22 81.81,53.76 81.81,53.28 Y+.1
  Bottom 0.305: Y+.1 81.92,53.66 79.22,56.36 72.55,56.36 U1.D15
Y-MIN
  Top 0.305: C13.2 78.65,53.91 Y-.1
  Bottom 0.305: Y-.1 79.38,53.66 77.31,55.72 70.64,55.72 U1.D14
Y-STEP
  Bottom 0.305: U1.A6
  Bottom 0.406: U1.A6 66.04,10.79 U$7.STEP
Z-DIR
  Bottom 0.305: U$8.DIR 90.17,14.92 92.71,17.46 92.71,20.95 U1.D48
Z-EN  (1 unrouted)
  Top 0.305: U1.A8 72.39,10.79 U$8.EN 73.93,13.6
Z-MAX
  Top 0.305: C16.2 88.85,57.09 87.9,56.15 87.9,54.09 Z+.1
  Bottom 0.305: Z+.1 87,53.97 84.61,56.36 82.71,56.36 U1.D19
Z-MIN
  Top 0.305: C15.2 84.25,53.39 Z-.1
  Bottom 0.305: Z-.1 84.45,53.66 81.76,56.36 80.17,56.36 U1.D18
Z-STEP
  Bottom 0.305: U$8.STEP 87.63,13.65 92.08,18.1 92.08,21.59 92.71,22.23 92.71,22.86 93.82,23.97 93.82,24.61 U1.D46
(copper drawn outside any net)
  shapes: Bottom circle x1

### Text on the board
tNames: 2B | 2A | 1A | 1B | 2B | 2A | 1A | 1B | E0 | S | - | E1 | + | MS1 | MS3 | MS1 | MS3 | T0 | T1 | T2 | 1A | 1B | 2B | 2A | 1A | 1B | 2B | 2A | 1A | 1B | X | + | MS2 | MS1 | MS3 | MS2 | MS1 | MS3 | MS2 | MS1 | MS3 | www.germanreprap.com | German RepRap GmbH | - | V1.4.2.3 | GPL3 | GND | 8 | + | 5A | AUX-1 | AUX-2 | AUX-3 | RESET | + | - | s | s | - | + | AUX-4 | SERVOS | 1 | 1
bNames: + | + | + | +
Document: RAMPS 1.4.2.1 (RepRap Arduino MEGA Pololu Shield) | GPL v3 | reprap.org/wiki/RAMPS1.4 | Reversing input power, and inserting stepper drivers incorrectly will destroy electronics. | I2C | 21 | 20 | 12-35V Out | GND | 5V | - | D10 | + | AUX-4 | D16 | - | D17 | D9 | + | D23 | D25 | - | D11 | D27 | + | D29 | D31 | 12-35VDC In | D33 | + | D35 | 11A | D37 | - | D38 | D41 | + | 5A | D43 | - | D45 | SERVOS | AUX-1 | AUX-2 | AUX-3 / SPI | D11 | D6 | D5 | D4 | D47 | A9 | A11 | SCK | MISO | D32 | 5V | GND | D2 | D1 | GND | D63 | D48 | D42 | D65 | GND | D52 | D50 | 5V | 5V | 5V | 5V | 5V | GND | 5V | GND | A3 | A4 | 5V | A5 | A10 | D44 | A12 | NC | D53 | MOSI | D49 | D57 | D58 | D59 | D64 | D66 | D51 | 5V | GND | GND | GND | GND | Copyright 2011 Johnny Russell - UltiMachine
_tsilk: + | I2C | END STOPS | 21 | 1 | 20 | 1 | - | + | 1 | + | 1 | 1 | 1 | 1 | 1 | 1 | 1 | -